# EAGLE board Replicape_A4A (EAGLE 6.5.0), part 1 of 2
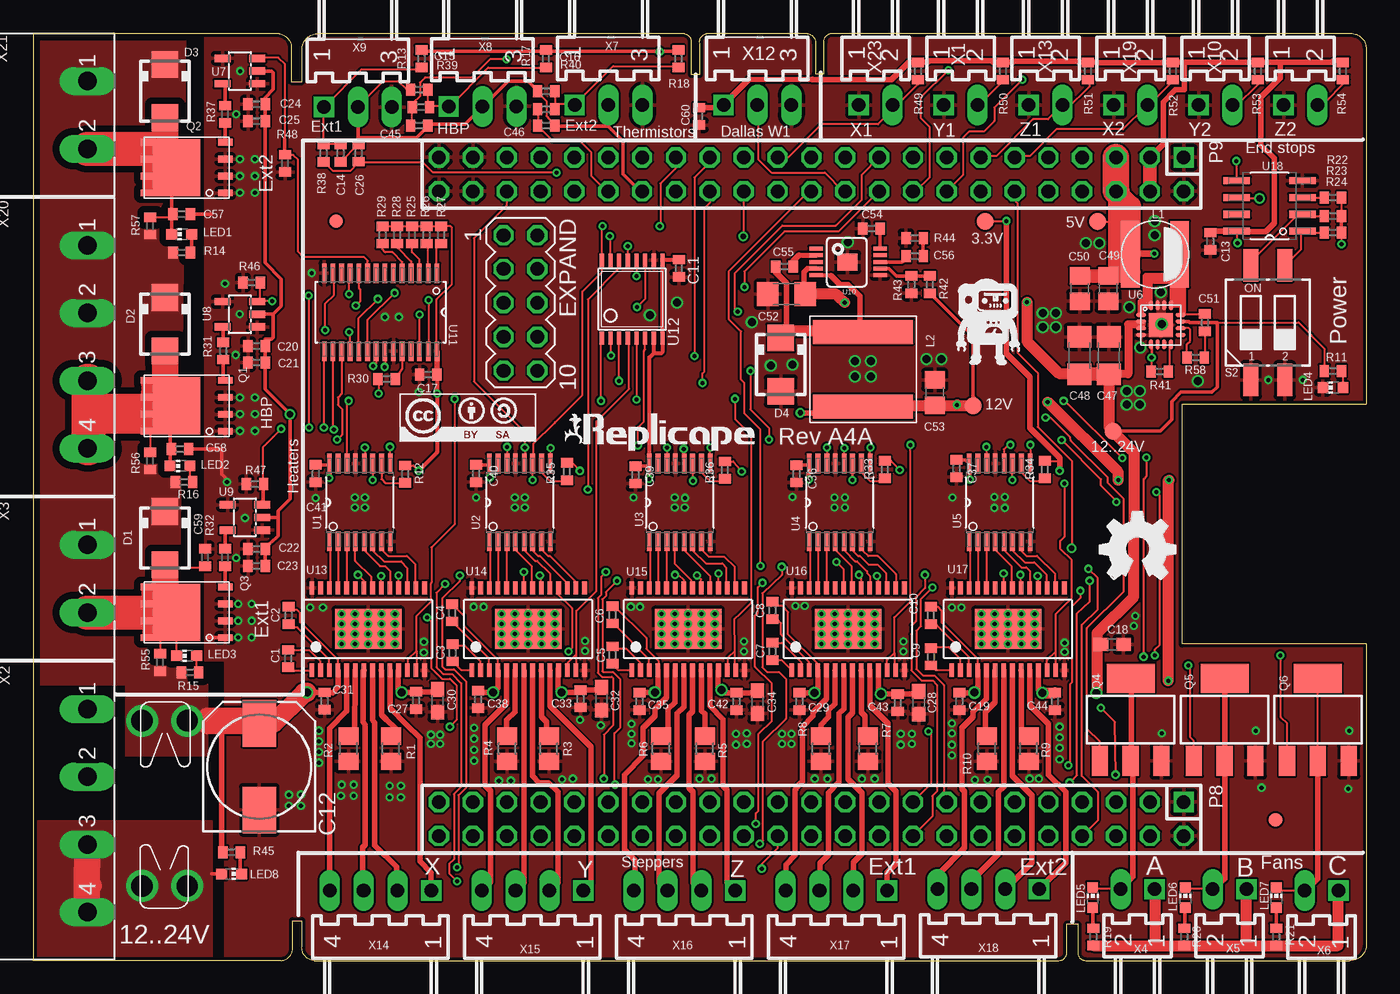
[diagram p3: board, top side]
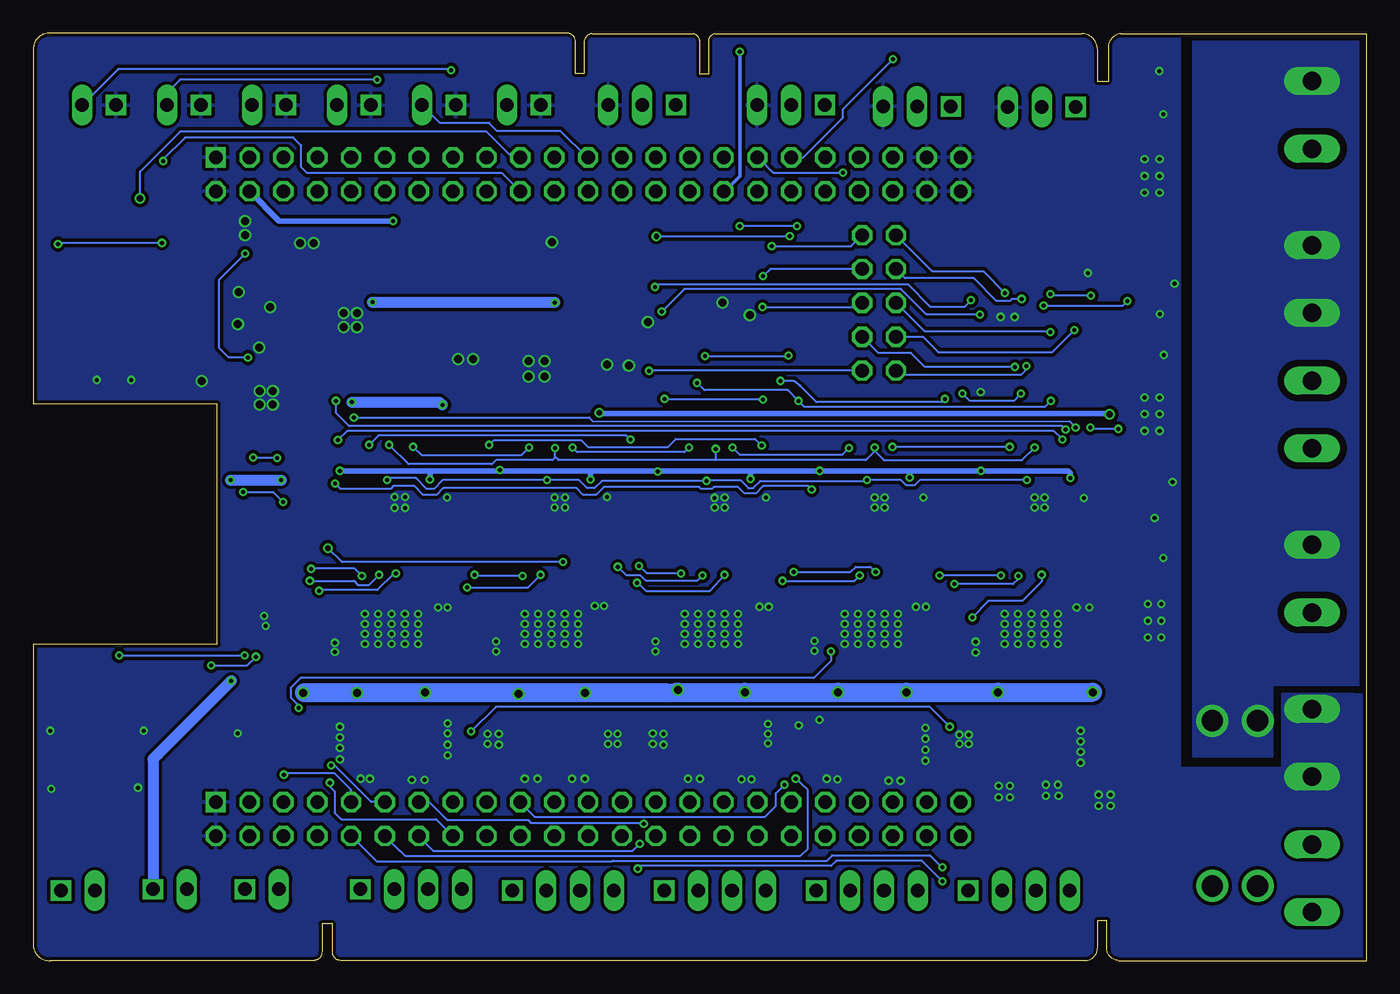
[diagram p4: board, bottom side, seen from below]

Size 100 x 69.58 mm. Coordinates in mm from the lower left corner, seen from the top.
Outline: 19.45,3 20.15,3 20.15,1.05 arc90 21.05,0 76.95,0 arc90 77.55,0.65 77.55,2.75 78.35,2.75 78.35,0.65 arc90 78.95,0 98.75,0 arc90 100,1.1 100,23.75 86.19,23.75 86.19,41.75 100,41.75 100,68.5 arc90 98.75,69.58 59.88,69.58 arc90 59.33,68.9 59.33,66.55 58.67,66.55 58.67,68.85 arc90 58.08,69.55 50.5,69.55 arc90 50,68.85 50,66.5 49.35,66.5 49.35,68.85 arc90 48.85,69.55 21.35,69.55 arc90 20.15,68.35 20.15,65.95 19.35,65.95 19.35,68.35 arc90 18.43,69.55 0,69.55 0,0 18.6,0 arc90 19.45,0.95 19.45,3
Copper layers (1*16): Top 0.035mm / dielectric 1.5mm / Bottom 0.035mm
Design rules "default": minimum track width 6mil, minimum drill 12mil, track to track 6mil, track to pad 6mil, pad to pad 6mil, via to via 6mil, smd to smd 0mil, copper to edge 10mil, drill to drill 10mil, minimum pad ring 10mil, minimum via ring 6mil, stop-mask expansion 2mil, vias tented up to drill 100mil, thermal gap 10mil
Net classes: 1 power: width 1.27 mm

## Footprints (pad centres in the part's own frame; a part is rotated, then mirrored left to right if it is on the bottom)
B1,27 = smd 1.27 x 1.27: TP 0,0
C0402 = smd 0.7 x 0.9: 1 -0.65,0; 2 0.65,0
140CLH-0810 = smd 3.5 x 2.5: + 3.25,0; - -3.25,0
C0603 = smd 1.1 x 1: 1 -0.85,0; 2 0.85,0
C1206 = smd 1.6 x 1.8: 1 -1.4,0; 2 1.4,0
C0805 = smd 1.3 x 1.5: 1 -0.95,0; 2 0.95,0
SMA = smd 2 x 2: A 2,0; C -2,0
MA05-2 = drill 1.016 octagon: 1 -5.08,-1.27; 2 -5.08,1.27; 3 -2.54,-1.27; 4 -2.54,1.27; 5 0,-1.27; 6 0,1.27; 7 2.54,-1.27; 8 2.54,1.27; 9 5.08,-1.27; 10 5.08,1.27
3557 = drill 1.6: 1 -6.2,1.7; 2 -6.2,-1.7; 3 6.2,-1.7; 4 6.2,1.7
FIDUCIAL-1X2.5 = smd 1 x 1: 1 0,0
VLC5020 = smd 5 x 1.4: 1 0,1.85; 2 0,-1.85
NR8040T330 = smd 1.8 x 7.5: P$1 2.8,0; P$2 -2.8,0
CHIP-LED0603 = smd 0.8 x 0.8: A 0,-0.75; C 0,0.75
DIL-100-2X23 = drill 1.016 square: 1 -27.94,-1.27 | drill 1.016 octagon: 2 -27.94,1.27; 3 -25.4,-1.27; 4 -25.4,1.27; 5 -22.86,-1.27; 6 -22.86,1.27; 7 -20.32,-1.27; 8 -20.32,1.27; 9 -17.78,-1.27; 10 -17.78,1.27; 11 -15.24,-1.27; 12 -15.24,1.27; 13 -12.7,-1.27; 14 -12.7,1.27; 15 -10.16,-1.27; 16 -10.16,1.27; 17 -7.62,-1.27; 18 -7.62,1.27; 19 -5.08,-1.27; 20 -5.08,1.27; 21 -2.54,-1.27; 22 -2.54,1.27; 23 0,-1.27; 24 0,1.27; 25 2.54,-1.27; 26 2.54,1.27; 27 5.08,-1.27; 28 5.08,1.27; 29 7.62,-1.27; 30 7.62,1.27; 31 10.16,-1.27; 32 10.16,1.27; 33 12.7,-1.27; 34 12.7,1.27; 35 15.24,-1.27; 36 15.24,1.27; 37 17.78,-1.27; 38 17.78,1.27; 39 20.32,-1.27; 40 20.32,1.27; 41 22.86,-1.27; 42 22.86,1.27; 43 25.4,-1.27; 44 25.4,1.27; 45 27.94,-1.27; 46 27.94,1.27
8-DFN-EP-(5X6) = smd 1.1 x 0.5: 1 -2.9,1.905; 2 -2.9,0.635; 3 -2.9,-0.635; 4 -2.9,-1.905; 5 2.9,-1.905; 6 2.9,-0.635; 7 2.9,0.635; 8 2.9,1.905 | smd 3.5 x 4.3: TH 0.75,0
SOT223 = smd 1.219 x 2.235: 1 -2.311,-3.099; 2 0,-3.099; 3 2.311,-3.099 | smd 3.6 x 2.2: 4 0,3.099
R0805 = smd 1.3 x 1.5: 1 -0.95,0; 2 0.95,0
R0402 = smd 0.7 x 0.9: 1 -0.65,0; 2 0.65,0
CTS-219-02 = smd 1.13 x 2.44: 1 -1.27,-4.3; 2 1.27,-4.3; 3 1.27,4.3; 4 -1.27,4.3
SOP65P640X120-16N = smd 1.473 x 0.356: 1 -2.921,2.286; 2 -2.921,1.626; 3 -2.921,0.965; 4 -2.921,0.33; 5 -2.921,-0.33; 6 -2.921,-0.965; 7 -2.921,-1.626; 8 -2.921,-2.286; 9 2.921,-2.286; 10 2.921,-1.626; 11 2.921,-0.965; 12 2.921,-0.33; 13 2.921,0.33; 14 2.921,0.965; 15 2.921,1.626; 16 2.921,2.286
QFN-16 = smd 0.75 x 0.3: 1 -1.475,0.75; 2 -1.475,0.25; 3 -1.475,-0.25; 4 -1.475,-0.75; 9 1.475,-0.75; 10 1.475,-0.25; 11 1.475,0.25; 12 1.475,0.75 | smd 0.3 x 0.75: 5 -0.75,-1.475; 6 -0.25,-1.475; 7 0.25,-1.475; 8 0.75,-1.475; 13 0.75,1.475; 14 0.25,1.475; 15 -0.25,1.475; 16 -0.75,1.475 | smd 1.8 x 1.8: P$17 0,0
SOT23-5L = smd 0.55 x 1.2: 1 -0.95,-1.3; 2 0,-1.3; 3 0.95,-1.3; 4 0.95,1.3; 5 -0.95,1.3
MSOP10 = smd 0.3 x 1: 1 -1,-2.4; 2 -0.5,-2.4; 3 0.005,-2.4; 4 0.5,-2.4; 5 1,-2.4; 6 1,2.4; 7 0.5,2.4; 8 0.005,2.4; 9 -0.5,2.4; 10 -1,2.4 | smd 1.3 x 1.5: EP 0.02,-0.04
SOP65P640X110-28N = smd 1.473 x 0.356: 1 -2.921,4.216; 2 -2.921,3.581; 3 -2.921,2.921; 4 -2.921,2.286; 5 -2.921,1.626; 6 -2.921,0.965; 7 -2.921,0.33; 8 -2.921,-0.33; 9 -2.921,-0.965; 10 -2.921,-1.626; 11 -2.921,-2.286; 12 -2.921,-2.921; 13 -2.921,-3.581; 14 -2.921,-4.216; 15 2.921,-4.216; 16 2.921,-3.581; 17 2.921,-2.921; 18 2.921,-2.286; 19 2.921,-1.626; 20 2.921,-0.965; 21 2.921,-0.33; 22 2.921,0.33; 23 2.921,0.965; 24 2.921,1.626; 25 2.921,2.286; 26 2.921,2.921; 27 2.921,3.581; 28 2.921,4.216
TSSOP-16 = smd 0.305 x 0.991: 1 -2.275,-2.918; 2 -1.625,-2.918; 3 -0.975,-2.918; 4 -0.325,-2.918; 5 0.325,-2.918; 6 0.975,-2.918; 7 1.625,-2.918; 8 2.275,-2.918; 9 2.275,2.918; 10 1.625,2.918; 11 0.975,2.918; 12 0.325,2.918; 13 -0.325,2.918; 14 -0.975,2.918; 15 -1.625,2.918; 16 -2.275,2.918
TSSOP-28 = smd 0.35 x 1: 1 -4.225,-3.087; 2 -3.575,-3.087; 3 -2.925,-3.087; 4 -2.275,-3.087; 5 -1.625,-3.087; 6 -0.975,-3.087; 7 -0.325,-3.087; 8 0.325,-3.087; 9 0.975,-3.087; 10 1.625,-3.087; 11 2.275,-3.087; 12 2.925,-3.087; 13 3.575,-3.087; 14 4.225,-3.087; 15 4.225,3.087; 16 3.575,3.087; 17 2.925,3.087; 18 2.275,3.087; 19 1.625,3.087; 20 0.975,3.087; 21 0.325,3.087; 22 -0.325,3.087; 23 -0.975,3.087; 24 -1.625,3.087; 25 -2.275,3.087; 26 -2.925,3.087; 27 -3.575,3.087; 28 -4.225,3.087 | smd 5 x 3: EXP 0,0
SOIC127P600X175-8N = smd 1.981 x 0.533: 1 -2.464,1.905; 2 -2.464,0.635; 3 -2.464,-0.635; 4 -2.464,-1.905; 5 2.464,-1.905; 6 2.464,-0.635; 7 2.464,0.635; 8 2.464,1.905
7395-02 = drill 1.016 square: 1 1.27,0 | drill 1.016 long: 2 -1.27,0
MSTBA4 = drill 1.397 long: 1 -7.62,5.08; 2 -2.54,5.08; 3 2.54,5.08; 4 7.62,5.08
MSTBA2 = drill 1.397 long: 1 -2.54,5.08; 2 2.54,5.08
7395-03 = drill 1.016 square: 1 2.54,0 | drill 1.016 long: 2 0,0; 3 -2.54,0
7395-04 = drill 1.016 square: 1 3.81,0 | drill 1.016 long: 2 1.27,0; 3 -1.27,0; 4 -3.81,0

## Placement (x,y rotation side)
3.3V  TPB1,27  [B1,27]  71.4,55.48 0 top
5V  TPB1,27  [B1,27]  79.85,55.45 0 top
12..24V  TPB1,27  [B1,27]  81,39.7 0 top
12V  TPB1,27  [B1,27]  70.5,41.63 0 top
C1  10nF  [C0402]  19.12,22.66 270 top
C2  0.1uF  [C0402]  19.15,25.9 270 top
C3  10nF  [C0402]  31.45,23.1 270 top
C4  0.1uF  [C0402]  31.43,26.1 270 top
C5  10nF  [C0402]  43.45,22.93 270 top
C6  0.1uF  [C0402]  43.46,25.95 270 top
C7  10nF  [C0402]  55.45,23.2 270 top
C8  0.1uF  [C0402]  55.45,26.28 270 top
C9  10nF  [C0402]  67.35,22.8 270 top
C10  0.1uF  [C0402]  67.33,25.9 270 top
C11  0.1uF  [C0402]  48.42,51.95 270 top
C12  100uF  [140CLH-0810]  16.95,14.55 90 top
C13  0.1uF  [C0402]  88.3,53.98 270 top
C14  0.47uF  [C0402]  23.05,60.58 270 top
C15  0.47uF  [C0402]  28.95,65.35 180 top
C16  0.47uF  [C0402]  38.48,65.23 180 top
C17  0.1uF  [C0402]  29.63,43.97 180 top
C18  4.7uF  [C0603]  80.94,23.72 0 top
C19  0.1uF  [C0402]  69.47,19.45 270 top
C20  0.1uF  [C0402]  16.75,46.13 180 top
C21  4.7uF  [C0402]  16.75,44.88 180 top
C22  0.1uF  [C0402]  16.75,30.88 180 top
C23  4.7uF  [C0402]  16.75,29.63 180 top
C24  0.1uF  [C0402]  16.75,64.25 180 top
C25  4.7uF  [C0402]  16.75,63 180 top
C26  0.47uF  [C0402]  24.4,60.6 90 top
C27  0.1uF  [C0402]  28.71,19.52 270 top
C28  4.7uF  [C0603]  66.42,19.35 270 top
C29  0.1uF  [C0402]  57.48,19.45 270 top
C30  4.7uF  [C0603]  30.32,19.5 270 top
C31  0.1uF  [C0402]  21.84,19.48 270 top
C32  4.7uF  [C0603]  42.62,19.65 270 top
C33  0.1uF  [C0402]  41.05,19.65 270 top
C34  4.7uF  [C0603]  54.33,19.4 270 top
C35  0.1uF  [C0402]  45.48,19.45 270 top
C36  0.1uF  [C0402]  57.27,36.52 270 top
C37  0.1uF  [C0402]  69.27,36.93 270 top
C38  0.1uF  [C0402]  33.38,19.6 270 top
C39  0.1uF  [C0402]  45.17,36.44 270 top
C40  0.1uF  [C0402]  33.22,36.55 270 top
C41  0.1uF  [C0402]  21.2,36.55 270 top
C42  0.1uF  [C0402]  52.75,19.45 270 top
C43  0.1uF  [C0402]  64.85,19.35 270 top
C44  0.1uF  [C0402]  76.65,19.45 270 top
C45  0.47uF  [C0402]  28.95,62.65 0 top
C46  0.47uF  [C0402]  38.48,62.65 0 top
C47  10uF  [C1206]  78.47,45.4 90 top
C48  10uF  [C1206]  80.7,45.4 90 top
C49  22uF  [C0805]  80.65,50.43 270 top
C50  22uF  [C0805]  78.5,50.43 270 top
C51  22nF  [C0402]  87.9,47.88 90 top
C52  10uF  [C1206]  56.5,50 180 top
C53  22uF  [C0805]  67.62,42.63 90 top
C54  10nF  [C0402]  62.88,54.93 180 top
C55  10nF  [C0402]  56.35,52.08 180 top
C56  1nF  [C0402]  66.12,52.85 0 top
C57  4.7nF  [C0402]  11.12,56 0 top
C58  4.7nF  [C0402]  11,38.38 0 top
C59  4.7nF  [C0402]  12.88,30.25 90 top
C60  0.47uF  [C0402]  49.96,63.35 270 top
D1  MBRA340T3  [SMA]  9.88,31.7 270 top
D2  MBRA340T3  [SMA]  9.88,47.75 270 top
D3  MBRA340T3  [SMA]  9.88,65.25 270 top
D4  MBRA340T3  [SMA]  56.08,44.73 270 top
EXPAND  EXPAND  [MA05-2]  36.55,49.35 270 top
F1  FUSE3557  [3557]  9.85,11.8 90 top
JP1  FIDUCIAL1X2.5  [FIDUCIAL-1X2.5]  22.73,55.48 0 top
JP2  FIDUCIAL1X2.5  [FIDUCIAL-1X2.5]  93.2,10.55 0 top
L1  4.7uH  [VLC5020]  84.15,53 270 top
L2  33uH  [NR8040T330]  62.25,44.38 270 top
LED1  blue  [CHIP-LED0603]  11.12,54.5 90 top
LED2  blue  [CHIP-LED0603]  11,37.13 90 top
LED3  blue  [CHIP-LED0603]  11.5,22.88 90 top
LED4  blue  [CHIP-LED0603]  97.5,43 90 top
LED5  blue  [CHIP-LED0603]  79.47,4.73 0 top
LED6  blue  [CHIP-LED0603]  86.42,4.73 0 top
LED7  blue  [CHIP-LED0603]  93.25,4.73 0 top
LED8  red  [CHIP-LED0603]  14.88,6.5 270 top
LOGO1  OSHW_LOGO_FILLX0200-NT  [OSHW_FILLX200_NOTEXT]  80.01,28.61 0 top
P8  F-2X23-  [DIL-100-2X23]  58.38,10.63 180 top
P9  F-2X23-  [DIL-100-2X23]  58.38,59 180 top
Q1  AON6758  [8-DFN-EP-(5X6)]  11.5,41.63 180 top
Q2  AON6758  [8-DFN-EP-(5X6)]  11.5,59.5 180 top
Q3  AON6758  [8-DFN-EP-(5X6)]  11.5,26.13 180 top
Q4  NIF5002  [SOT223]  82.33,18.08 0 top
Q5  NIF5002  [SOT223]  89.38,18.08 0 top
Q6  NIF5002  [SOT223]  96.38,18.08 0 top
R1  0.1R  [R0805]  26.82,15.9 90 top
R2  0.1R  [R0805]  23.65,15.9 90 top
R3  0.1R  [R0805]  38.67,15.9 90 top
R4  0.1R  [R0805]  35.55,15.9 90 top
R5  0.1R  [R0805]  50.38,15.9 90 top
R6  0.1R  [R0805]  47.1,15.9 90 top
R7  0.1R  [R0805]  62.62,15.9 90 top
R8  0.1R  [R0805]  59.1,15.9 90 top
R9  0.1R  [R0805]  74.67,15.9 90 top
R10  0.1R  [R0805]  71.55,15.9 90 top
R11  4.7K  [R0402]  97.5,44.25 180 top
R12  4.7K  [R0402]  27.9,36.5 90 top
R13  4K7, 1%  [R0402]  29.12,67.68 90 top
R14  4.7K  [R0402]  11.12,53.13 180 top
R15  4.7K  [R0402]  11.75,21.63 180 top
R16  4.7K  [R0402]  11.3,35.9 180 top
R17  4K7, 1%  [R0402]  38.45,67.68 90 top
R18  4K7, 1%  [R0402]  48.4,67.68 90 top
R19  4.7K  [R0402]  79.53,1.78 270 top
R20  4.7K  [R0402]  86.35,1.78 270 top
R21  4.7K  [R0402]  93.25,1.78 270 top
R22  4.7K  [R0402]  97.5,57.25 0 top
R23  4.7K  [R0402]  97.5,55.88 0 top
R24  4.7K  [R0402]  97.5,54.63 0 top
R25  4.7K  [R0402]  28.4,54.45 90 top
R26  4.7K  [R0402]  29.5,54.45 90 top
R27  4.7K  [R0402]  30.6,54.45 90 top
R28  4.7K  [R0402]  27.3,54.45 90 top
R29  4.7K  [R0402]  26.2,54.45 90 top
R30  4.7K  [R0402]  26.5,43.65 180 top
R31  100R  [R0402]  14.25,45.75 90 top
R32  100R  [R0402]  14.38,30.25 90 top
R33  4.7K  [R0402]  63.88,36.85 90 top
R34  4.7K  [R0402]  75.88,36.85 90 top
R35  4.7K  [R0402]  40.02,36.7 90 top
R36  4.7K  [R0402]  51.88,36.8 90 top
R37  100R  [R0402]  14.38,63.5 90 top
R38  6.8K  [R0402]  21.77,60.58 270 top
R39  6.8K  [R0402]  29.07,64.05 180 top
R40  6.8K  [R0402]  38.48,63.88 180 top
R41  10K  [R0402]  84.5,44.2 180 top
R42  120K  [R0402]  67.25,50.73 90 top
R43  10K  [R0402]  65.88,50.73 270 top
R44  40K  [R0402]  66.12,54.23 180 top
R45  4.7K  [R0402]  14.88,8.13 0 top
R46  4.7K  [R0402]  16.38,50.88 0 top
R47  4.7K  [R0402]  16.62,35.75 0 top
R48  4.7K  [R0402]  18.88,59.83 90 top
R49  1k  [R0402]  66.38,66.75 90 top
R50  1k  [R0402]  72.75,66.75 90 top
R51  1k  [R0402]  79.12,66.75 90 top
R52  1k  [R0402]  85.5,66.75 90 top
R53  1k  [R0402]  91.88,66.75 90 top
R54  1k  [R0402]  98.25,66.75 90 top
R55  4.7K  [R0402]  9.5,22.38 270 top
R56  4.7K  [R0402]  8.75,37.5 270 top
R57  4.7K  [R0402]  8.75,55.13 270 top
R58  100R  [R0402]  87.2,45.25 180 top
S2  219-02  [CTS-219-02]  92.62,47.88 0 top
U1  SN74AHC595PW  [SOP65P640X120-16N]  24.5,34.38 90 top
U2  SN74AHC595PW  [SOP65P640X120-16N]  36.5,34.38 90 top
U3  SN74AHC595PW  [SOP65P640X120-16N]  48.5,34.38 90 top
U4  SN74AHC595PW  [SOP65P640X120-16N]  60.5,34.38 90 top
U5  SN74AHC595PW  [SOP65P640X120-16N]  72.5,34.38 90 top
U6  MCP16321  [QFN-16]  84.6,47.7 0 top
U7  MCP1402  [SOT23-5L]  15.5,66.75 90 top
U8  MCP1402  [SOT23-5L]  15.5,48.5 90 top
U9  MCP1402  [SOT23-5L]  15.88,33.25 90 top
U10  RT8268  [MSOP10]  61.12,52.43 270 top
U11  PCA9685PW  [SOP65P640X110-28N]  26.05,48.65 270 top
U12  DAC088S085  [TSSOP-16]  44.92,49.63 0 top
U13  DRV8825PWP  [TSSOP-28]  25.12,24.88 0 top
U14  DRV8825PWP  [TSSOP-28]  37.12,24.88 0 top
U15  DRV8825PWP  [TSSOP-28]  49.12,24.88 0 top
U16  DRV8825PWP  [TSSOP-28]  61.12,24.88 0 top
U17  DRV8825PWP  [TSSOP-28]  73.12,24.88 0 top
U18  CAT24C256  [SOIC127P600X175-8N]  92.75,56.63 180 top
U$1  [LOGO_BIG]  71.2,48 0 top
U$2  REPLICAPE-LOGO  [REPLICAPE-LOGO]  39.47,37.69 0 top
U$3  CC-BY-SA  [CC-BY-SA]  32.75,41.2 0 top
X1  22-05-7028-02  [7395-02]  69.58,64.2 180 top
X2  MSTBA4  [MSTBA4]  -1.02,11.25 270 top
X3  MSTBA2  [MSTBA2]  -1.02,28.65 270 top
X4  22-05-7028-02  [7395-02]  82.85,5.35 0 top
X5  22-05-7028-02  [7395-02]  89.75,5.35 0 top
X6  22-05-7028-02  [7395-02]  96.65,5.25 0 top
X7  22-05-7038-03  [7395-03]  43.15,64.2 180 top
X8  22-05-7038-03  [7395-03]  33.7,64.1 180 top
X9  22-05-7038-03  [7395-03]  24.35,64.05 180 top
X10  22-05-7028-02  [7395-02]  88.7,64.2 180 top
X11  22-05-7028-02  [7395-02]  95.08,64.2 180 top
X12  22-05-7038-03  [7395-03]  54.33,64.2 180 top
X13  22-05-7028-02  [7395-02]  75.95,64.2 180 top
X14  22-05-7048-04  [7395-04]  26.05,5.25 0 top
X15  22-05-7048-04  [7395-04]  37.45,5.25 0 top
X16  22-05-7048-04  [7395-04]  48.85,5.25 0 top
X17  22-05-7048-04  [7395-04]  60.25,5.25 0 top
X18  22-05-7048-04  [7395-04]  71.65,5.35 0 top
X19  22-05-7028-02  [7395-02]  82.33,64.2 180 top
X20  MSTBA4  [MSTBA4]  -1.02,46.05 270 top
X21  MSTBA2  [MSTBA2]  -1.02,63.45 270 top
X23  22-05-7028-02  [7395-02]  63.2,64.2 180 top